# Altium schematic sheet cpu.SchDoc: ESP32 Module
size A3; Author: Pietro Lorefice; Address3: Firenze; Address4: ITALY; Revision: 0; SheetNumber: 2; SheetTotal: 2; License: GPLv3
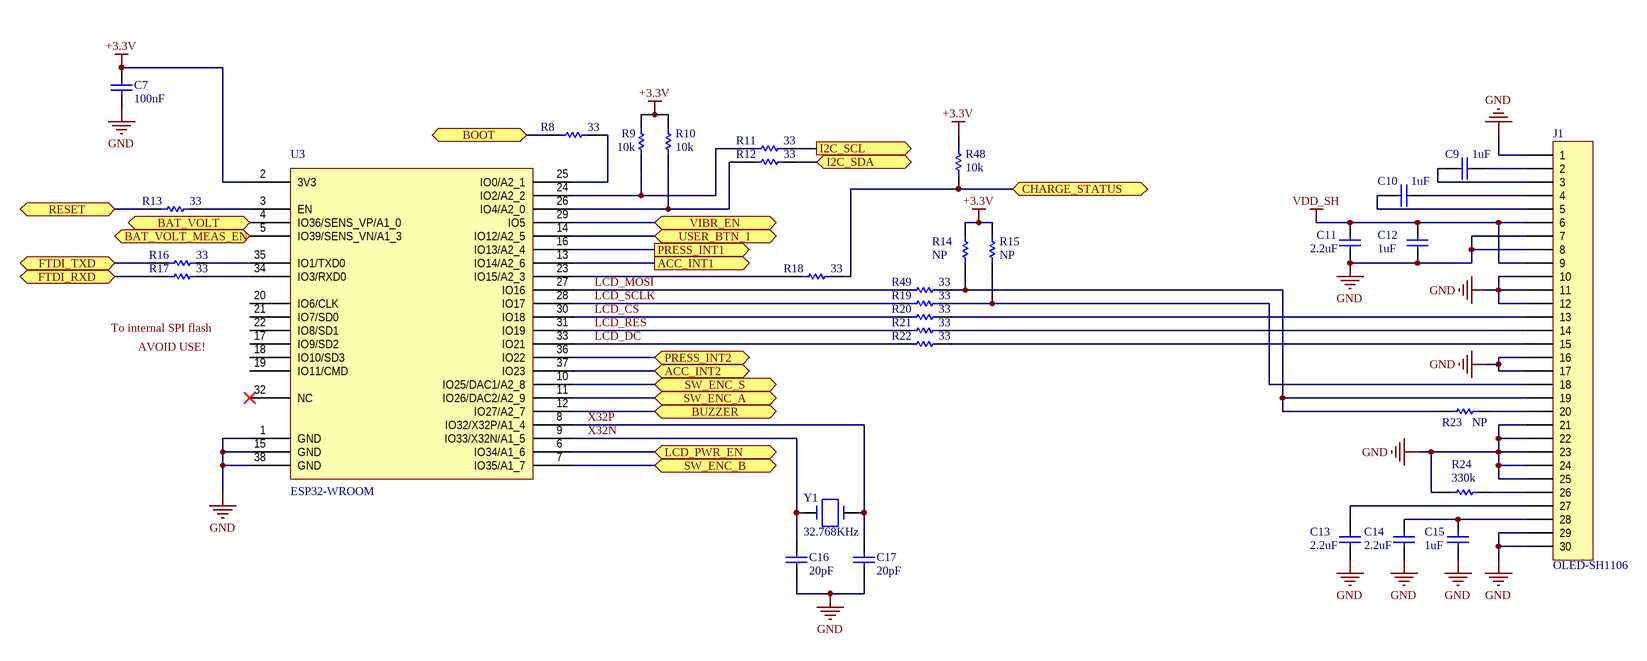
[diagram p0: cpu.SchDoc]

## Parts
C7  100nF  [0402_[1005]]
C9  1uF  [0603_[1608]]
C10  1uF  [0603_[1608]]
C11  2.2uF  [0603_[1608]]
C12  1uF  [0603_[1608]]
C13  2.2uF  [0603_[1608]]
C14  2.2uF  [0603_[1608]]
C15  1uF  [0603_[1608]]
C16  20pF  [0402_[1005]]
C17  20pF  [0402_[1005]]
J1  OLED-SH1106  [flat_30pin_0,7mm]
R8  33  [0402_[1005]]
R9  10k  [0402_[1005]]
R10  10k  [0402_[1005]]
R11  33  [0402_[1005]]
R12  33  [0402_[1005]]
R13  33  [0402_[1005]]
R14  NP  [0402_[1005]]
R15  NP  [0402_[1005]]
R16  33  [0402_[1005]]
R17  33  [0402_[1005]]
R18  33  [0402_[1005]]
R19  33  [0402_[1005]]
R20  33  [0402_[1005]]
R21  33  [0402_[1005]]
R22  33  [0402_[1005]]
R23  NP  [0402_[1005]]
R24  330k  [0402_[1005]]
R48  10k  [0402_[1005]]
R49  33  [0402_[1005]]
U3  ESP32-WROOM  [ESP-WROOM-32]
Y1  32.768KHz  [CRYSTAL_3.2X1.5MM_2P_SMD]

## Ports
ACC_INT1 (out), ACC_INT2 (bidir), BAT_VOLT (bidir), BAT_VOLT_MEAS_EN (bidir), BOOT (bidir), BUZZER (bidir), CHARGE_STATUS (bidir), FTDI_RXD (bidir), FTDI_TXD (bidir), I2C_SCL (out), I2C_SDA (bidir), LCD_PWR_EN (bidir), PRESS_INT1 (out), PRESS_INT2 (bidir), RESET (bidir), SW_ENC_A (bidir), SW_ENC_B (bidir), SW_ENC_S (bidir), USER_BTN_1 (bidir), VIBR_EN (bidir)

## Nets
+3.3V: C7.2 R9.2 R10.2 R14.2 R15.2 R48.2 U3.2(3V3)
GND: C7.1 C11.1 C12.1 C13.1 C14.1 C15.1 C16.1 C17.1 J1.1 J1.7 J1.8 J1.10 J1.11 J1.12 J1.16 J1.17 J1.21 J1.22 J1.23 J1.24 J1.25 J1.29 J1.30 R24.2 U3.1(GND) U3.15(GND) U3.38(GND)
VDD_SH: C11.2 C12.2 J1.6 J1.9
ACC_INT1: U3.13(IO14/A2_6) ; port ACC_INT1
ACC_INT2: U3.37(IO23) ; port ACC_INT2
BAT_VOLT: U3.4(IO36/SENS_VP/A1_0) ; port BAT_VOLT
BAT_VOLT_MEAS_EN: U3.5(IO39/SENS_VN/A1_3) ; port BAT_VOLT_MEAS_EN
BOOT: R8.1 ; port BOOT
BUZZER: U3.12(IO27/A2_7) ; port BUZZER
CHARGE_STATUS: R18.2 R48.1 ; port CHARGE_STATUS
FTDI_RXD: R17.1 ; port FTDI_RXD
FTDI_TXD: R16.1 ; port FTDI_TXD
I2C_SCL: R11.2 ; port I2C_SCL
I2C_SDA: R12.2 ; port I2C_SDA
LCD_CS: R20.1 U3.30(IO18)
LCD_DC: R22.1 U3.33(IO21)
LCD_MOSI: R49.1 U3.27(IO16)
LCD_PWR_EN: U3.6(IO34/A1_6) ; port LCD_PWR_EN
LCD_RES: R21.1 U3.31(IO19)
LCD_SCLK: R19.1 U3.28(IO17)
PRESS_INT1: U3.16(IO13/A2_4) ; port PRESS_INT1
PRESS_INT2: U3.36(IO22) ; port PRESS_INT2
RESET: R13.1 ; port RESET
SW_ENC_A: U3.11(IO26/DAC2/A2_9) ; port SW_ENC_A
SW_ENC_B: U3.7(IO35/A1_7) ; port SW_ENC_B
SW_ENC_S: U3.10(IO25/DAC1/A2_8) ; port SW_ENC_S
USER_BTN_1: U3.14(IO12/A2_5) ; port USER_BTN_1
VIBR_EN: U3.29(IO5) ; port VIBR_EN
X32N: C16.2 U3.9(IO33/X32N/A1_5) Y1.1
X32P: C17.2 U3.8(IO32/X32P/A1_4) Y1.2
NetC9_1: C9.1 J1.2
NetC9_2: C9.2 J1.3
NetC10_1: C10.1 J1.4
NetC10_2: C10.2 J1.5
NetC13_2: C13.2 J1.27
NetC14_2: C14.2 C15.2 J1.28
NetJ1_13: J1.13 R20.2
NetJ1_14: J1.14 R21.2
NetJ1_15: J1.15 R22.2
NetJ1_18: J1.18 R15.1 R19.2
NetJ1_19: J1.19 R14.1 R23.1 R49.2
NetJ1_20: J1.20 R23.2
NetJ1_26: J1.26 R24.1
NetR8_2: R8.2 U3.25(IO0/A2_1)
NetR9_1: R9.1 R11.1 U3.24(IO2/A2_2)
NetR10_1: R10.1 R12.1 U3.26(IO4/A2_0)
NetR13_2: R13.2 U3.3(EN)
NetR16_2: R16.2 U3.35(IO1/TXD0)
NetR17_2: R17.2 U3.34(IO3/RXD0)
NetR18_1: R18.1 U3.23(IO15/A2_3)

Not connected (* = marked no-connect by the designer): U3 17(IO9/SD2) 18(IO10/SD3) 19(IO11/CMD) 20(IO6/CLK) 21(IO7/SD0) 22(IO8/SD1) 32(NC)*

## Notes on the sheet
- Title:
- Author:
- 8-Team
- File:
- License:
- Approved:
- Rev:
- github.com/8-Team
- Date:
- Time:
- Sheet
- of
- (in symbol ESP32-WROOM) To internal SPI flash; AVOID USE!

## Library data of the parts
C7 = Cap: Capacitor; Value: 0.1uF; Published: 8-Jun-2000; LatestRevisionDate: 17-Jul-2002; LatestRevisionNote: Re-released for DXP Platform.; PackageReference: RAD-0.3; Publisher: Altium Limited; PackageDescription: Radial Cap, Thru-Hole; 2 Leads; 0.3 in Pin Spacing
C9-C17 = Cap: Capacitor; Value: 10nF; Published: 8-Jun-2000; Revision: July-2002: Re-released for DXP Platform.; Publisher: Altium Limited
J1 = Header 30: Header, 30-Pin; LatestRevisionDate: 17-Jul-2002; LatestRevisionNote: Re-released for DXP Platform.; Publisher: Altium Limited
R8 R11-R13 R16-R23 R49 = Res1: Resistor; Value: NC; Published: 8-Jun-2000; LatestRevisionDate: 17-Jul-2002; LatestRevisionNote: Re-released for DXP Platform.; PackageReference: AXIAL-0.3; Publisher: Altium Limited; PackageDescription: Axial Device, Thru-Hole; 2 Leads; 0.3 in Pin Spacing
R9 R10 R14 R15 R48 = Res1: Resistor; Value: 4.7K; Published: 8-Jun-2000; LatestRevisionDate: 17-Jul-2002; LatestRevisionNote: Re-released for DXP Platform.; PackageReference: AXIAL-0.3; Publisher: Altium Limited; PackageDescription: Axial Device, Thru-Hole; 2 Leads; 0.3 in Pin Spacing
R24 = Res1: Resistor; Published: 8-Jun-2000; LatestRevisionDate: 17-Jul-2002; LatestRevisionNote: Re-released for DXP Platform.; PackageReference: AXIAL-0.3; Publisher: Altium Limited; PackageDescription: Axial Device, Thru-Hole; 2 Leads; 0.3 in Pin Spacing; Value: 330K
U3 = ESP32-WROOM: Wi-Fi+BT+BLE MCU module based on ESP32-D0WDQ6
Y1 = 24MHZ-SMD: Crystal 24 MHz SMT 25X2 Low Profile; Part Number: Aker C2E-24.000-12-3030-X; Purchase Code: RS 671-9564